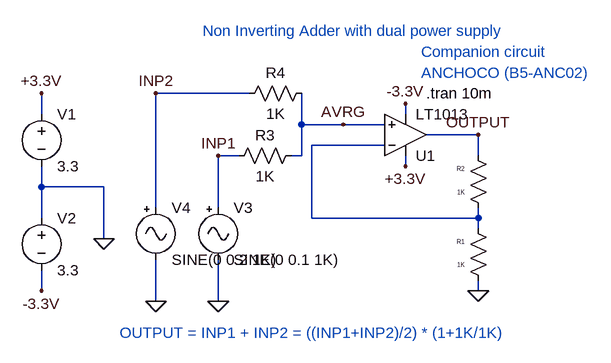
[diagram p0: schematic non_inverting_adder_with_dual_pow.asc]
non_inverting_adder_with_dual_pow.asc, the LTspice schematic file:
Version 4
SHEET 1 948 680
WIRE -224 0 -368 0
WIRE -544 32 -544 0
WIRE 16 32 16 16
WIRE -144 48 -144 0
WIRE -80 48 -144 48
WIRE -16 48 -80 48
WIRE 128 64 48 64
WIRE -16 80 -128 80
WIRE -240 96 -272 96
WIRE -144 96 -144 48
WIRE -144 96 -160 96
WIRE 128 96 128 64
WIRE 16 112 16 96
WIRE -544 144 -544 112
WIRE -448 144 -544 144
WIRE -368 176 -368 0
WIRE -272 176 -272 96
WIRE -544 192 -544 144
WIRE -128 192 -128 80
WIRE 128 192 128 176
WIRE 128 192 -128 192
WIRE 128 208 128 192
WIRE -448 224 -448 144
WIRE -544 304 -544 272
WIRE 128 304 128 288
WIRE -368 320 -368 256
WIRE -272 320 -272 256
FLAG -448 224 0
FLAG -544 0 +3.3V
FLAG -544 304 -3.3V
FLAG 16 112 +3.3V
FLAG 16 16 -3.3V
FLAG -272 320 0
FLAG 128 64 OUTPUT
FLAG 128 304 0
FLAG -368 320 0
FLAG -272 96 INP1
FLAG -368 0 INP2
FLAG -80 48 AVRG
SYMBOL voltage -544 16 R0
WINDOW 123 0 0 Left 0
WINDOW 39 0 0 Left 0
SYMATTR InstName V1
SYMATTR Value 3.3
SYMBOL voltage -544 176 R0
WINDOW 123 0 0 Left 0
WINDOW 39 0 0 Left 0
SYMATTR InstName V2
SYMATTR Value 3.3
SYMBOL res 144 304 R180
WINDOW 0 36 76 Left 0
WINDOW 3 36 40 Left 0
SYMATTR InstName R1
SYMATTR Value 1K
SYMBOL res 144 192 R180
WINDOW 0 36 76 Left 0
WINDOW 3 36 40 Left 0
SYMATTR InstName R2
SYMATTR Value 1K
SYMBOL Misc\\signal -272 160 R0
WINDOW 123 0 0 Left 0
WINDOW 39 0 0 Left 0
SYMATTR InstName V3
SYMATTR Value SINE(0 0.1 1K)
SYMBOL Opamps\\LT1013 16 128 M180
SYMATTR InstName U1
SYMBOL Misc\\signal -368 160 R0
WINDOW 123 0 0 Left 0
WINDOW 39 0 0 Left 0
SYMATTR InstName V4
SYMATTR Value SINE(0 0.2 1K)
SYMBOL res -144 80 R90
WINDOW 0 0 56 VBottom 2
WINDOW 3 32 56 VTop 2
SYMATTR InstName R3
SYMATTR Value 1K
SYMBOL res -128 -16 R90
WINDOW 0 0 56 VBottom 2
WINDOW 3 32 56 VTop 2
SYMATTR InstName R4
SYMATTR Value 1K
TEXT 48 0 Left 2 !.tran 10m
TEXT -296 -96 Left 2 ;Non Inverting Adder with dual power supply
TEXT 40 -32 Left 2 ;ANCHOCO (B5-ANC02)
TEXT 40 -64 Left 2 ;Companion circuit
TEXT -424 368 Left 2 ;OUTPUT = INP1 + INP2 = ((INP1+INP2)/2) * (1+1K/1K)

The netlist it stands for:
* non_inverting_adder_with_dual_pow.asc
V1 +3.3V 0 3.3
V2 0 -3.3V 3.3
R1 0 N001 1K
R2 N001 OUTPUT 1K
V3 INP1 0 SINE(0 0.1 1K)
XU1 AVRG N001 +3.3V -3.3V OUTPUT LT1013  ; pins In+ In- V+ V- OUT
V4 INP2 0 SINE(0 0.2 1K)
R3 AVRG INP1 1K
R4 AVRG INP2 1K
.tran 10m
* Non Inverting Adder with dual power supply
* ANCHOCO (B5-ANC02)
* Companion circuit
* OUTPUT = INP1 + INP2 = ((INP1+INP2)/2) * (1+1K/1K)
.lib LTC.lib
.backanno
.end